# Altium schematic sheet MOSFET_JUNCTION.SchDoc
size C; SheetNumber: 2; SheetTotal: 9
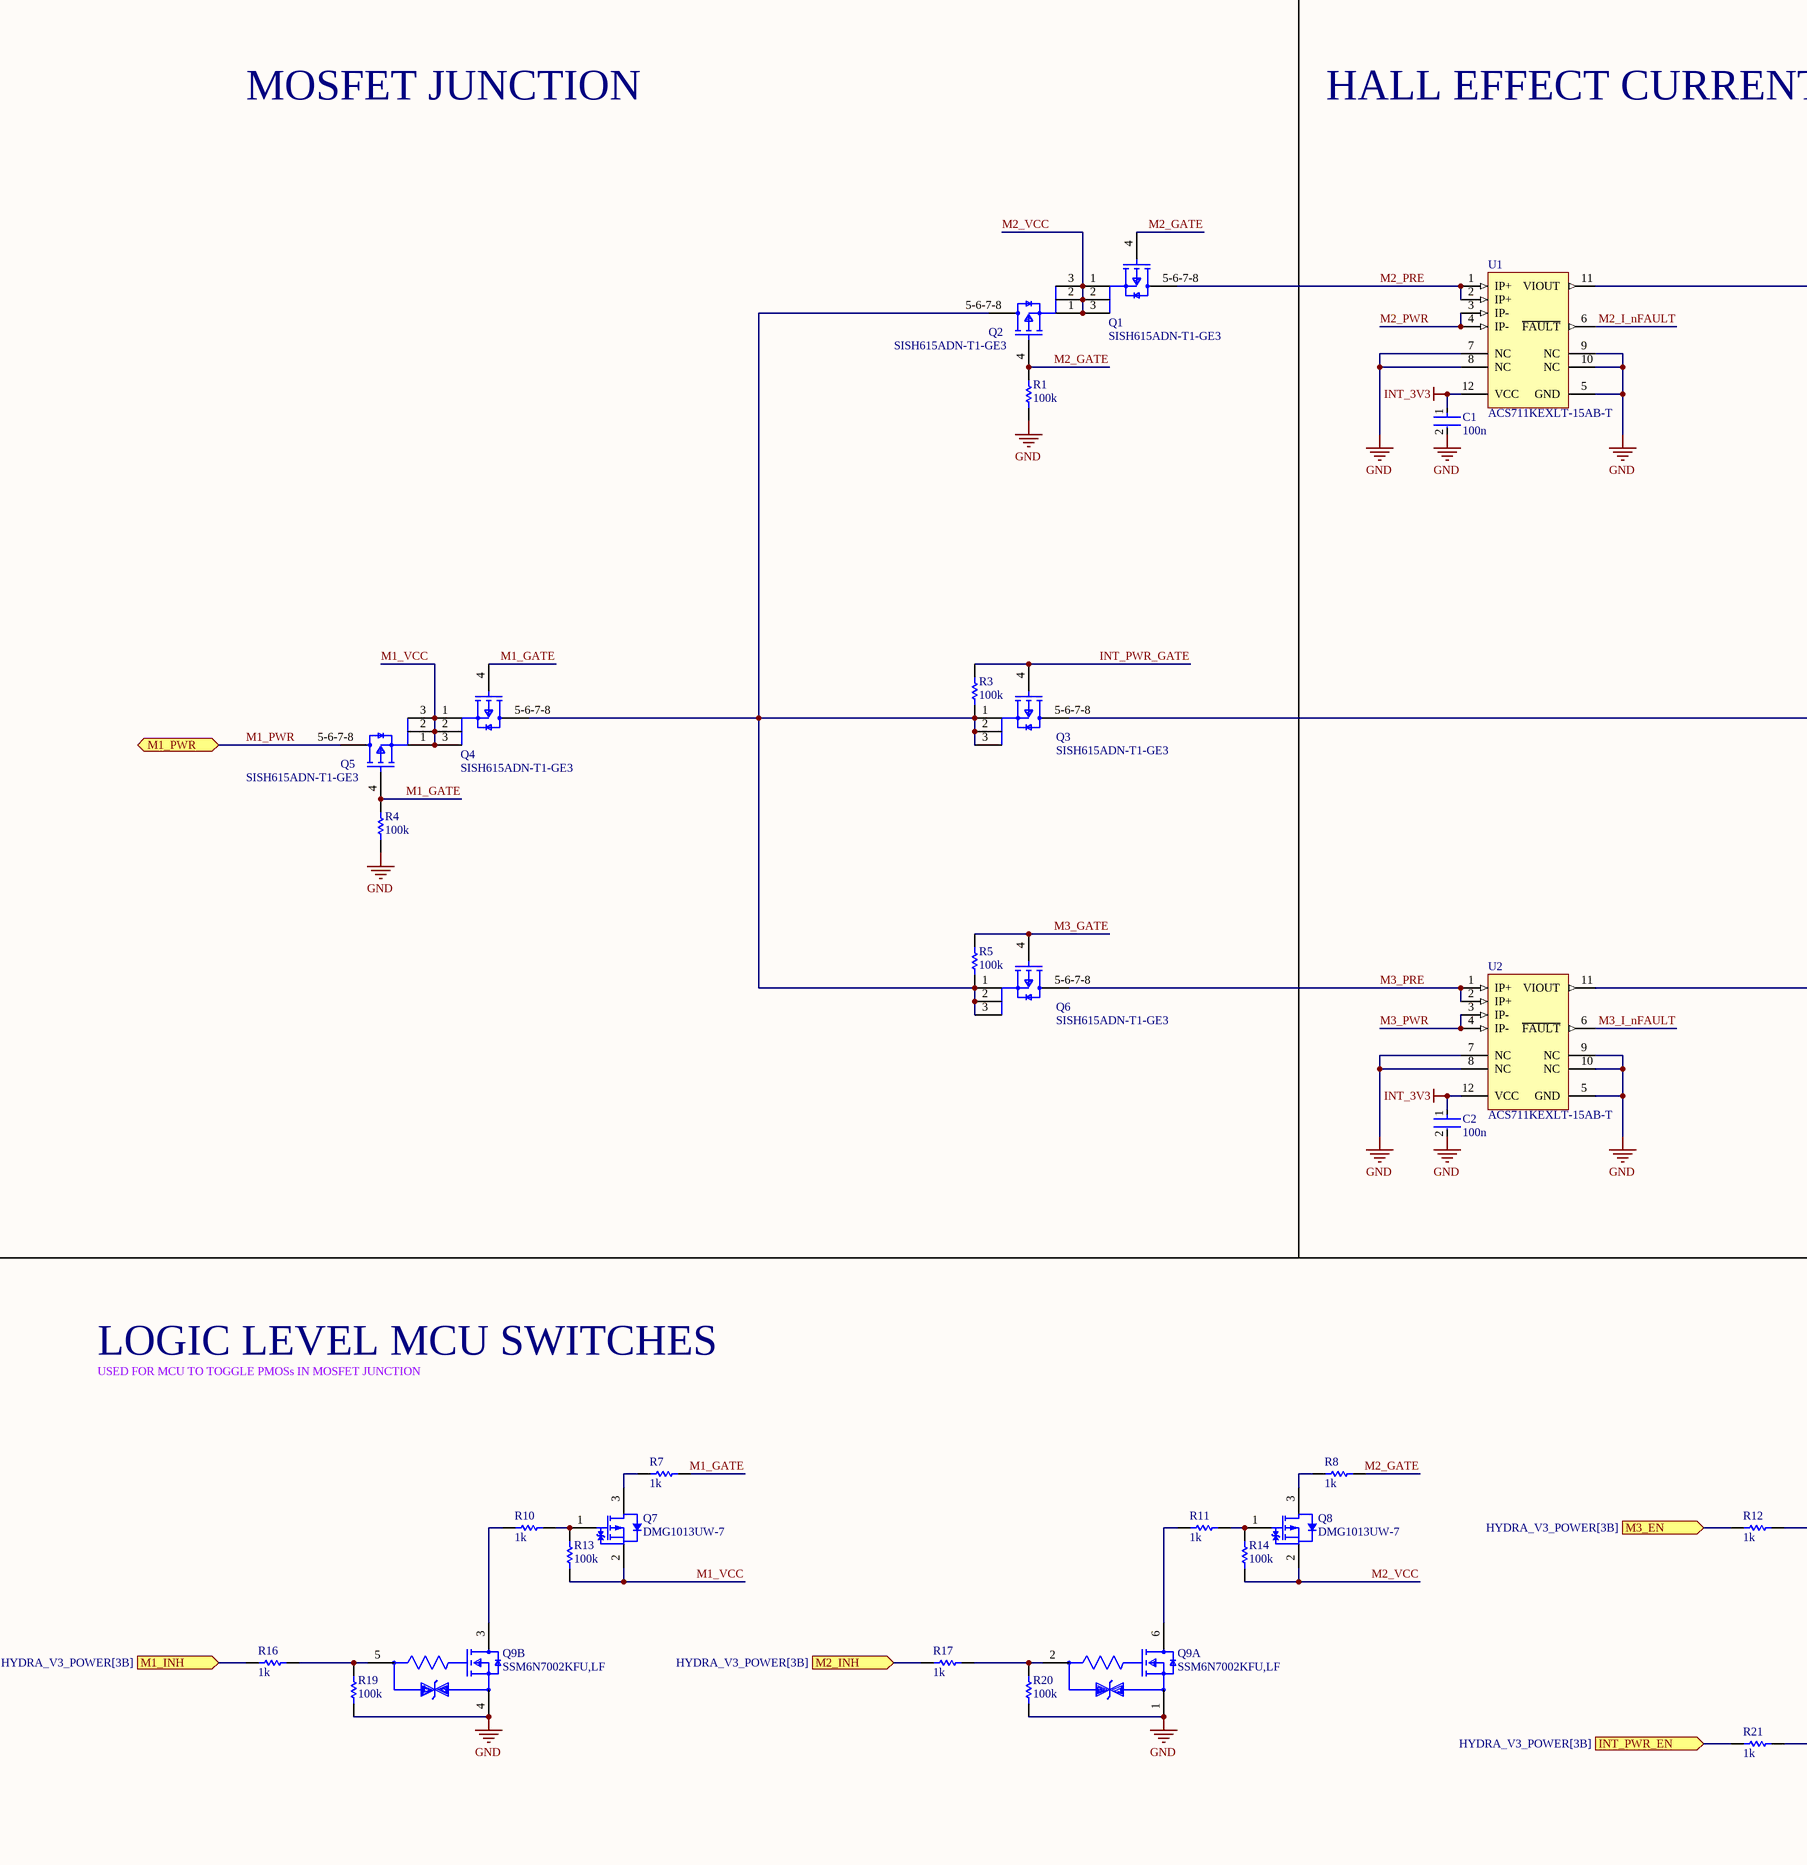
[diagram p0: MOSFET_JUNCTION.SchDoc, left]
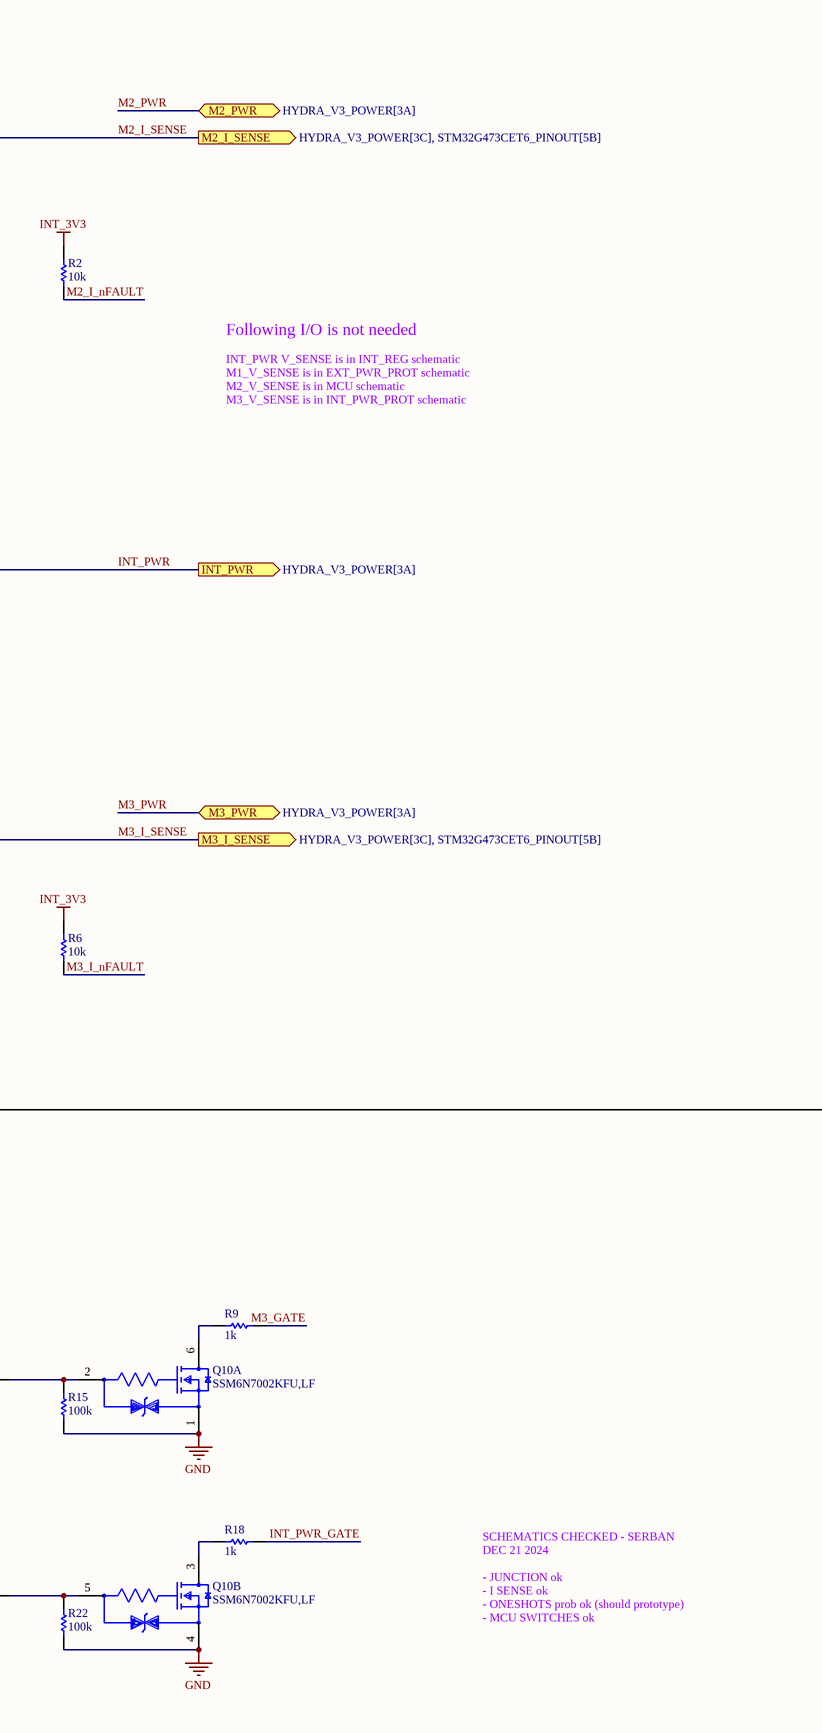
[diagram p1: MOSFET_JUNCTION.SchDoc, right]

## Parts
C1  100n  [FP-0402-L_1_0_0_05-W_0_5-IPC_A]
C2  100n  [FP-0402-L_1_0_0_05-W_0_5-IPC_A]
Q1  SISH615ADN-T1-GE3  [SISH615ADN-T1-GE3-Footprint-1]
Q2  SISH615ADN-T1-GE3  [SISH615ADN-T1-GE3-Footprint-1]
Q3  SISH615ADN-T1-GE3  [SISH615ADN-T1-GE3-Footprint-1]
Q4  SISH615ADN-T1-GE3  [SISH615ADN-T1-GE3-Footprint-1]
Q5  SISH615ADN-T1-GE3  [SISH615ADN-T1-GE3-Footprint-1]
Q6  SISH615ADN-T1-GE3  [SISH615ADN-T1-GE3-Footprint-1]
Q7  DMG1013UW-7  [DIOD-SOT323-3_V]
Q8  DMG1013UW-7  [DIOD-SOT323-3_V]
Q9  SSM6N7002KFU,LF  [FP-SSOP6-P-0_65A-MFG]  (parts A,B of 2)
Q10  SSM6N7002KFU,LF  [FP-SSOP6-P-0_65A-MFG]  (parts A,B of 2)
R1  100k  [R0603B]
R2  10k  [R0603B]
R3  100k  [R0603B]
R4  100k  [R0603B]
R5  100k  [R0603B]
R6  10k  [R0603B]
R7  1k  [R0603B]
R8  1k  [R0603B]
R9  1k  [R0603B]
R10  1k  [R0603B]
R11  1k  [R0603B]
R12  1k  [R0603B]
R13  100k  [R0603B]
R14  100k  [R0603B]
R15  100k  [R0603B]
R16  1k  [R0603B]
R17  1k  [R0603B]
R18  1k  [R0603B]
R19  100k  [R0603B]
R20  100k  [R0603B]
R21  1k  [R0603B]
R22  100k  [R0603B]
U1  ACS711KEXLT-15AB-T  [ALEG-EX-12_V]
U2  ACS711KEXLT-15AB-T  [ALEG-EX-12_V]

## Ports
INT_PWR (out, see HYDRA_V3_POWER[3A]), INT_PWR_EN (in, see HYDRA_V3_POWER[3B]), M1_INH (in, see HYDRA_V3_POWER[3B]), M1_PWR (bidir, see HYDRA_V3_POWER[3A]), M2_I_SENSE (out, see HYDRA_V3_POWER[3C], STM32G473CET6_PINOUT[5B]), M2_INH (in, see HYDRA_V3_POWER[3B]), M2_PWR (bidir, see HYDRA_V3_POWER[3A]), M3_EN (in, see HYDRA_V3_POWER[3B]), M3_I_SENSE (out, see HYDRA_V3_POWER[3C], STM32G473CET6_PINOUT[5B]), M3_PWR (bidir, see HYDRA_V3_POWER[3A])

## Nets
GND: C1.2 C2.2 Q9.1(Source1) Q9.4(Source2) Q10.1(Source1) Q10.4(Source2) R1.1 R4.1 R15.1 R19.1 R20.1 R22.1 U1.5(GND) U1.7(NC) U1.8(NC) U1.9(NC) U1.10(NC) U2.5(GND) U2.7(NC) U2.8(NC) U2.9(NC) U2.10(NC)
INT_3V3: C1.1 C2.1 R2.2 R6.2 U1.12(VCC) U2.12(VCC)
INT_PWR: Q3.5-6-7-8(D) ; port INT_PWR
INT_PWR_EN: R21.2 ; port INT_PWR_EN
INT_PWR_GATE: Q3.4(G) R3.2 R18.1
M1_GATE: Q4.4(G) Q5.4(G) R4.2 R7.1
M1_INH: R16.2 ; port M1_INH
M1_PWR: Q5.5-6-7-8(D) ; port M1_PWR
M1_VCC: Q4.1(S) Q4.2(S) Q4.3(S) Q5.1(S) Q5.2(S) Q5.3(S) Q7.2(S) R13.2
M2_GATE: Q1.4(G) Q2.4(G) R1.2 R8.1
M2_I_nFAULT: R2.1 U1.6(~{FAULT})
M2_I_SENSE: U1.11(VIOUT) ; port M2_I_SENSE
M2_INH: R17.2 ; port M2_INH
M2_PRE: Q1.5-6-7-8(D) U1.1(IP+) U1.2(IP+)
M2_PWR: U1.3(IP-) U1.4(IP-) ; port M2_PWR
M2_VCC: Q1.1(S) Q1.2(S) Q1.3(S) Q2.1(S) Q2.2(S) Q2.3(S) Q8.2(S) R14.2
M3_EN: R12.2 ; port M3_EN
M3_GATE: Q6.4(G) R5.2 R9.1
M3_I_nFAULT: R6.1 U2.6(~{FAULT})
M3_I_SENSE: U2.11(VIOUT) ; port M3_I_SENSE
M3_PRE: Q6.5-6-7-8(D) U2.1(IP+) U2.2(IP+)
M3_PWR: U2.3(IP-) U2.4(IP-) ; port M3_PWR
NetQ2_5-6-7-8: Q2.5-6-7-8(D) Q3.1(S) Q3.2(S) Q3.3(S) Q4.5-6-7-8(D) Q6.1(S) Q6.2(S) Q6.3(S) R3.1 R5.1
NetQ7_1: Q7.1(G) R10.1 R13.1
NetQ7_3: Q7.3(D) R7.2
NetQ8_1: Q8.1(G) R11.1 R14.1
NetQ8_3: Q8.3(D) R8.2
NetQ9_2: Q9.2(Gate1) R17.1 R20.2
NetQ9_3: Q9.3(Drain2) R10.2
NetQ9_5: Q9.5(Gate2) R16.1 R19.2
NetQ9_6: Q9.6(Drain1) R11.2
NetQ10_2: Q10.2(Gate1) R12.1 R15.2
NetQ10_3: Q10.3(Drain2) R18.2
NetQ10_5: Q10.5(Gate2) R21.1 R22.2
NetQ10_6: Q10.6(Drain1) R9.2

## Notes on the sheet
- MOSFET JUNCTION
- HALL EFFECT CURRENT SENSE
- INT_PWR V_SENSE is in INT_REG schematic
- M1_V_SENSE is in EXT_PWR_PROT schematic
- M2_V_SENSE is in MCU schematic
- Following I/O is not needed
- M3_V_SENSE is in INT_PWR_PROT schematic
- LOGIC LEVEL MCU SWITCHES
- USED FOR MCU TO TOGGLE PMOSs IN MOSFET JUNCTION
- SCHEMATICS CHECKED - SERBAN
  DEC 21 2024
  - JUNCTION ok
  - I SENSE ok
  - ONESHOTS prob ok (should prototype)
  - MCU SWITCHES ok

## Library data of the parts
C1 C2 = CMP-001-00058-1: LARGE PADS, 0402 CAP, CHANGE COMMENT TO MATCH REAL P/N; Capacitor Type: Ceramic; Min Operating Temperature: -55°C; Mounting Technology: Surface Mount; Pins: 2; Case/Package: 0402; RoHS Compliant: Yes; Max Operating Temperature: 85°C
Q1-Q6 = CMP-013-00018-2: Trans MOSFET P-CH 20V 22.1A 8-Pin PowerPAK 1212 EP T/R; Source: SISH615ADN-T1-GE3.SchLib; Design Item ID: CMP-013-00036-4; Component Type: Standard; Pins: 5
Q7 Q8 = CMP-2000-06170-1: P-Channel Enhancement Mode MOSFET, 310 mW, 20 V, -55 to 150 degC, 3-Pin SOT-323, RoHS, Tape and Reel; Manufacturer: Diodes Inc; Qg Gate Charge: 0.622nC; Drain-Source On Resistance-Max: 750mO; Rated Power Dissipation: 310mW; Drain-to-Source Voltage [Vdss]: 20V; Package Reference: SOT323; Datasheet Version: Rev. 3-2, 09/2013; Package Description: 3-Pin Small Outline Transistor, Body 2 x 1.25 mm, Pitch 0.65 mm; Mounting Technology: SurfaceMount; Manufacturer URL: http://www.diodes.com/; Datasheet URL: http://www.diodes.com/_files/datasheets/ds31861.pdf; Channel Type: P-Channel
Q9 Q10 = CMP-35916-000009-1: MOSFET 2N-CH 60V 0.3A; Input Capacitance: 40pF; Continuous Drain Current (ID): 300mA; Max Power Dissipation: 285mW; FET Type: 2 N-Channel; Rds On Max: 1.5R; Mount: Surface Mount; Drain to Source Voltage (Vdss): 60V; Packaging: Tape and Reel
R1-R22 = CMP-009-00002-14: Resistor
U1 U2 = CMP-1557-00001-1: Hall Effect Linear Current Sensor with Overcurrent Fault Output for <100 V Isolation Applications, 3 to 5.5 V, -15.5 to 15.5 A IP, -40 to 125 degC, 12-Pin QFN (EX), RoHS, Tape and Reel; VCC Max: 5.5 V; IP Max: 15.5 A; VCC Min: 3 V; IP Min: -15.5 A; -3dB Bandwidth: 0.1 MHz; PackageDescription: 12-Pin Quad Flat No-Lead, Body 3 x 3 mm, Height 0.8 mm; ComponentLink1URL: http://www.allegromicro.com/; Packing: Tape and Reel; ComponentLink2URL: http://www.allegromicro.com/~/media/Files/Datasheets/ACS711-Datasheet.ashx?la=en; DatasheetVersion: Rev. 3; PartNumber: ACS711KEXLT-15AB-T; ComponentLink2Description: Datasheet; ComponentLink3URL: http://www.allegromicro.com/~/media/Files/Datasheets/ACS711-Datasheet.ashx?la=en; RoHS: TRUE; ComponentLink1Description: Manufacturer URL; ComponentLink3Description: Package Specification; Temperature Max: 125 degC; Mounting Technology: Surface Mount; Temperature Min: -40 degC